# Altium project eco_gyro_analyze.PrjPcb
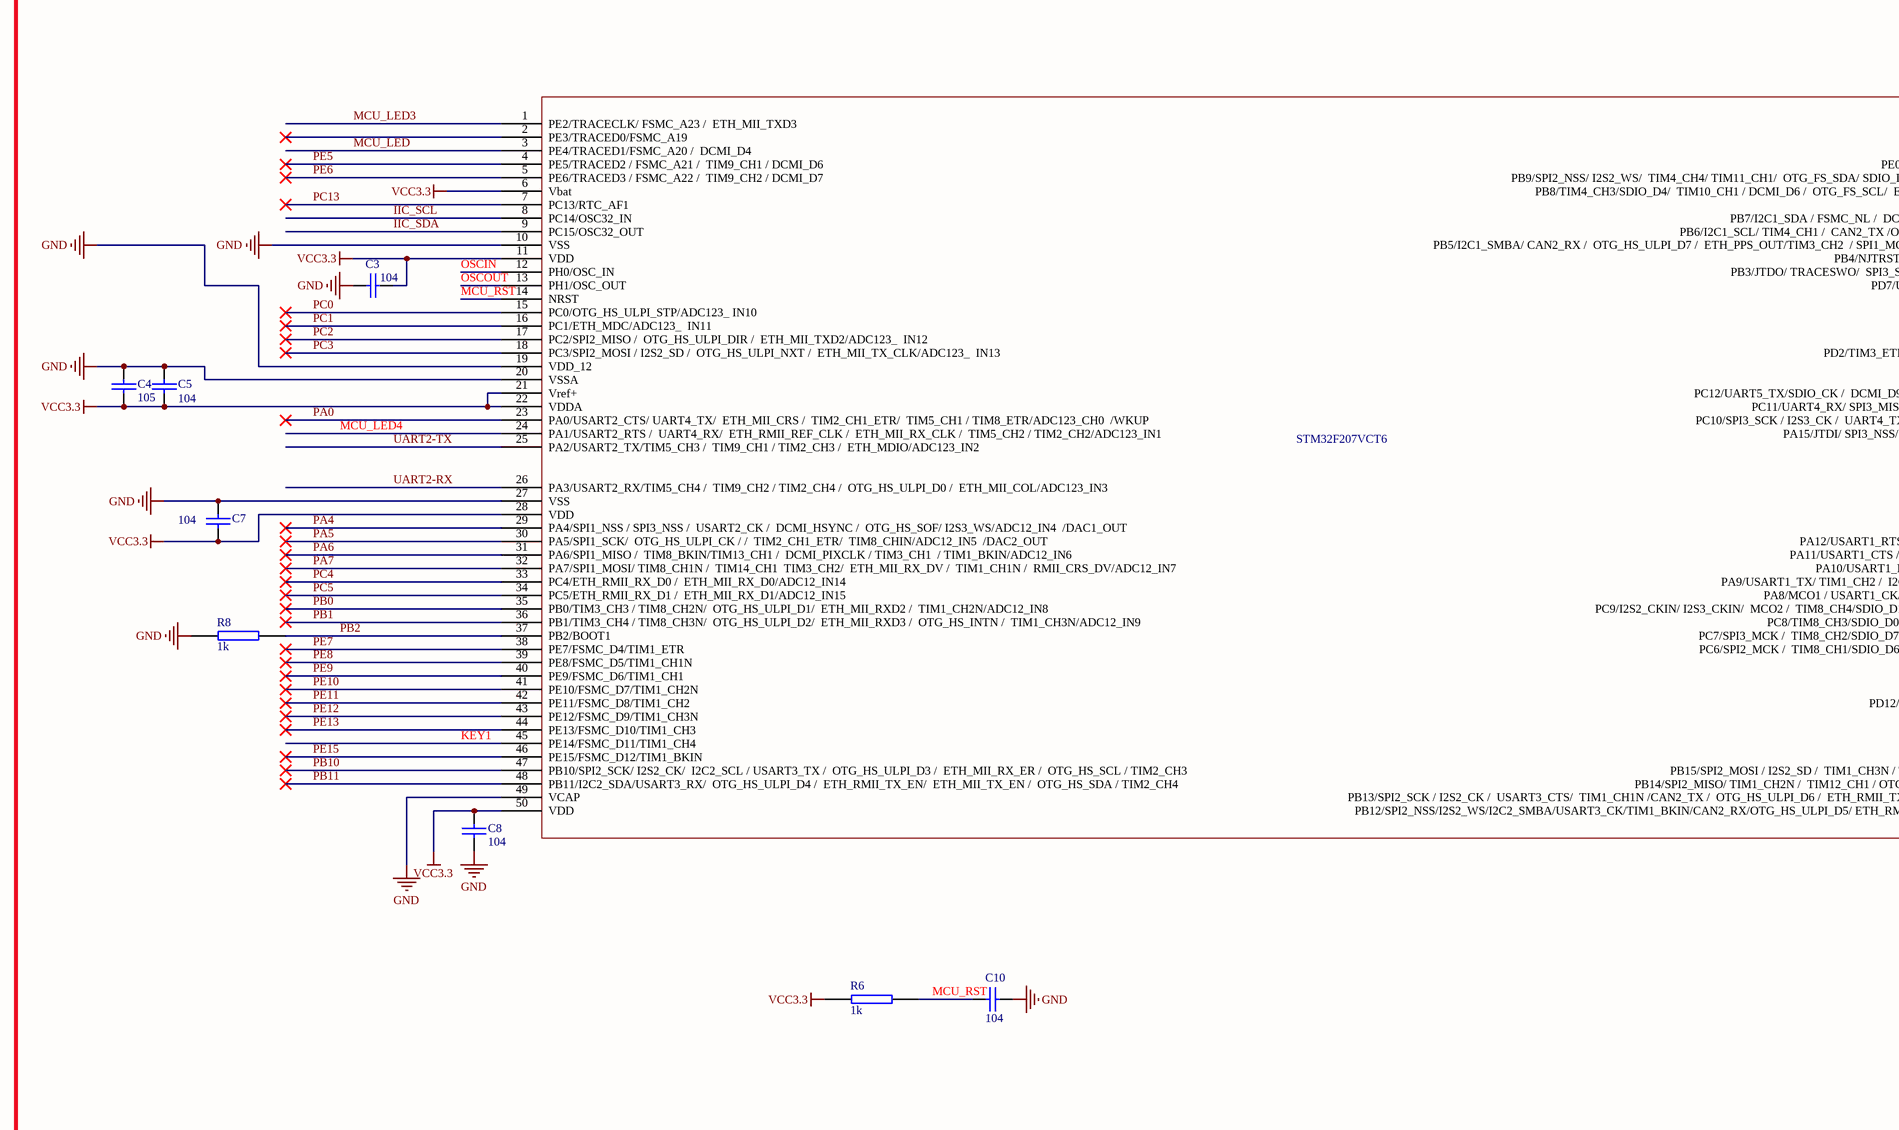
[diagram p0: Sheet1.SchDoc, top left]
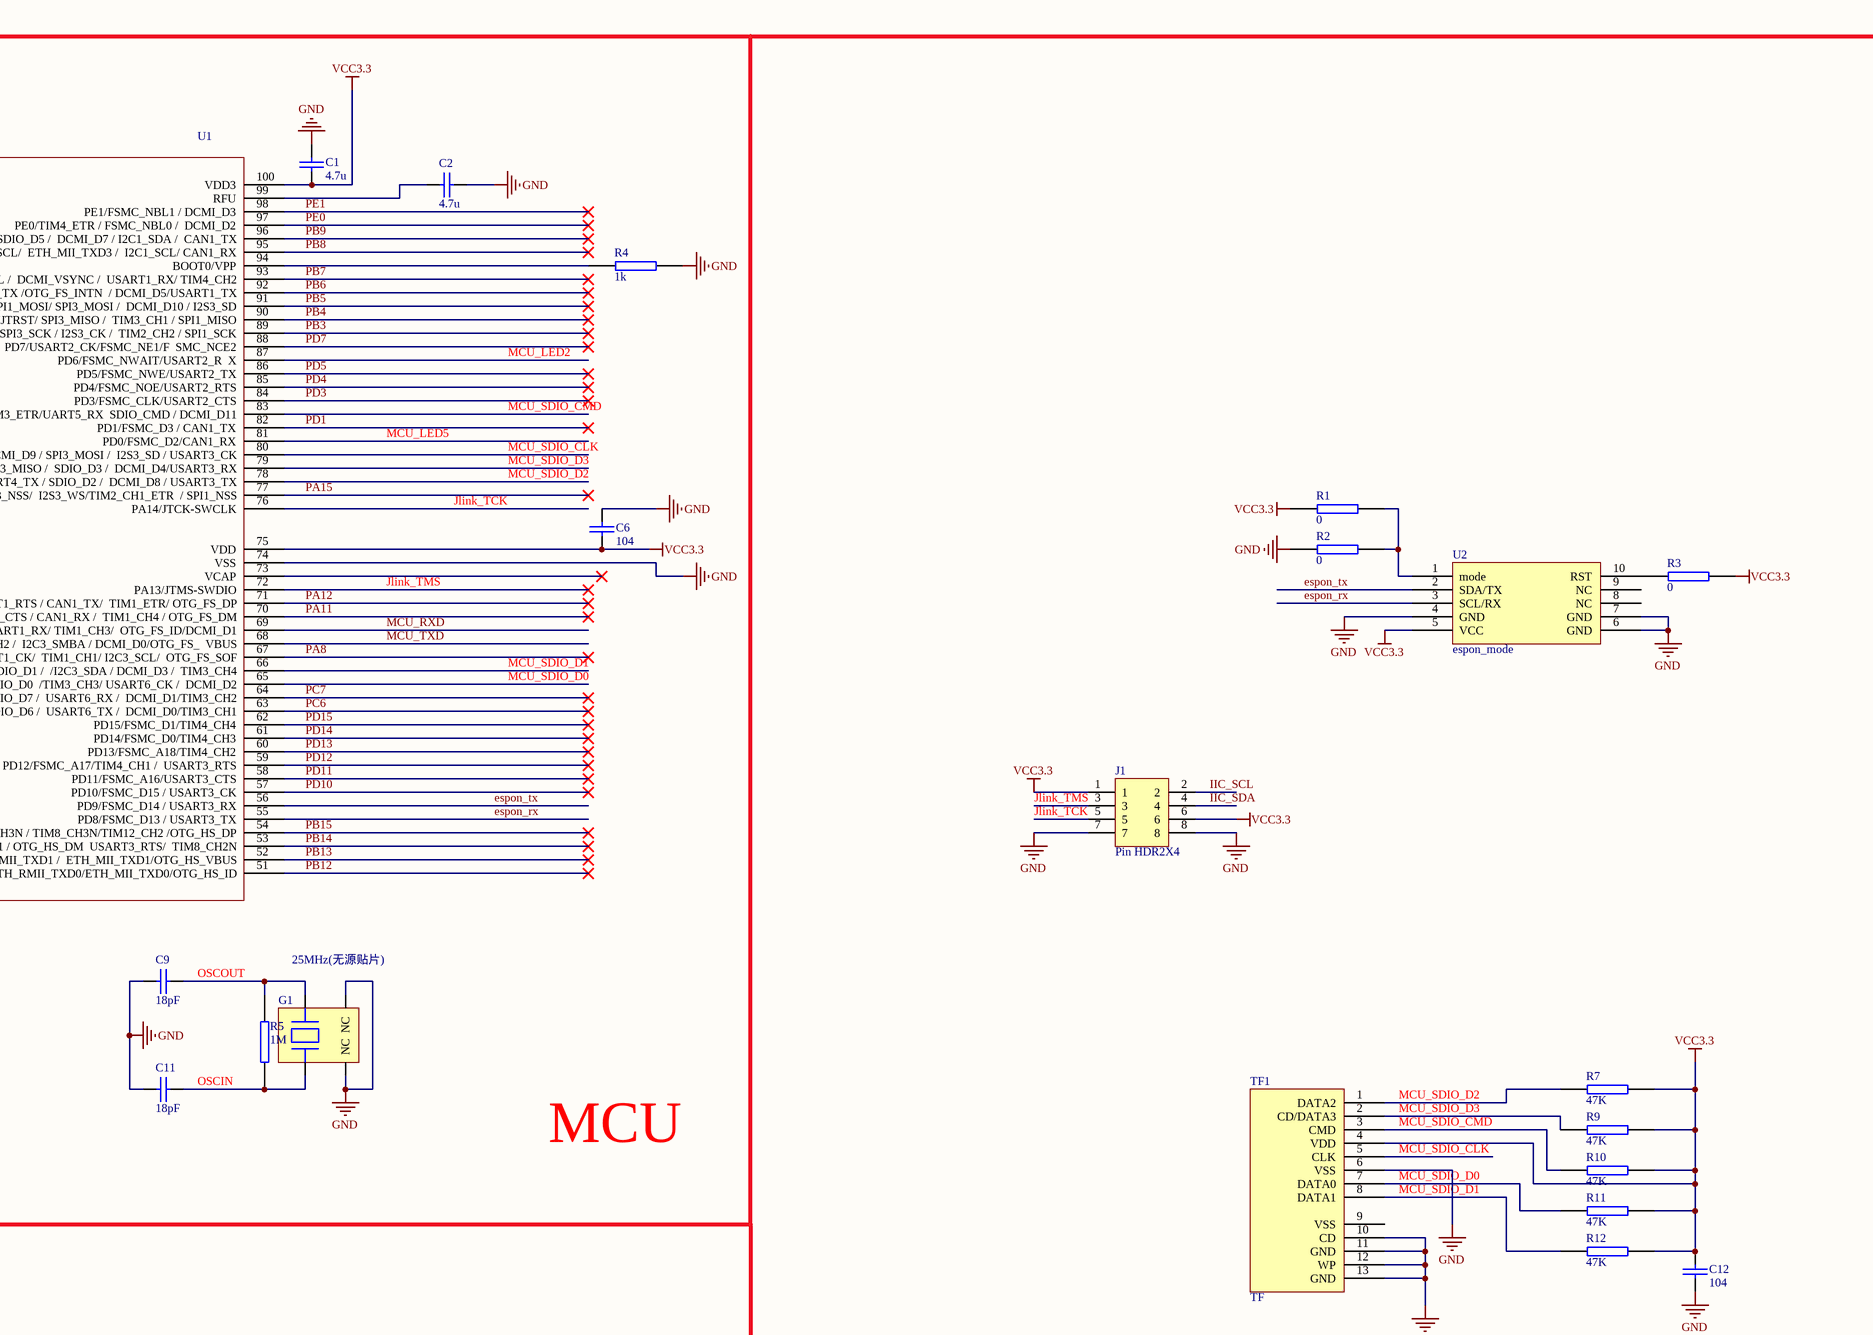
[diagram p1: Sheet1.SchDoc, top middle]
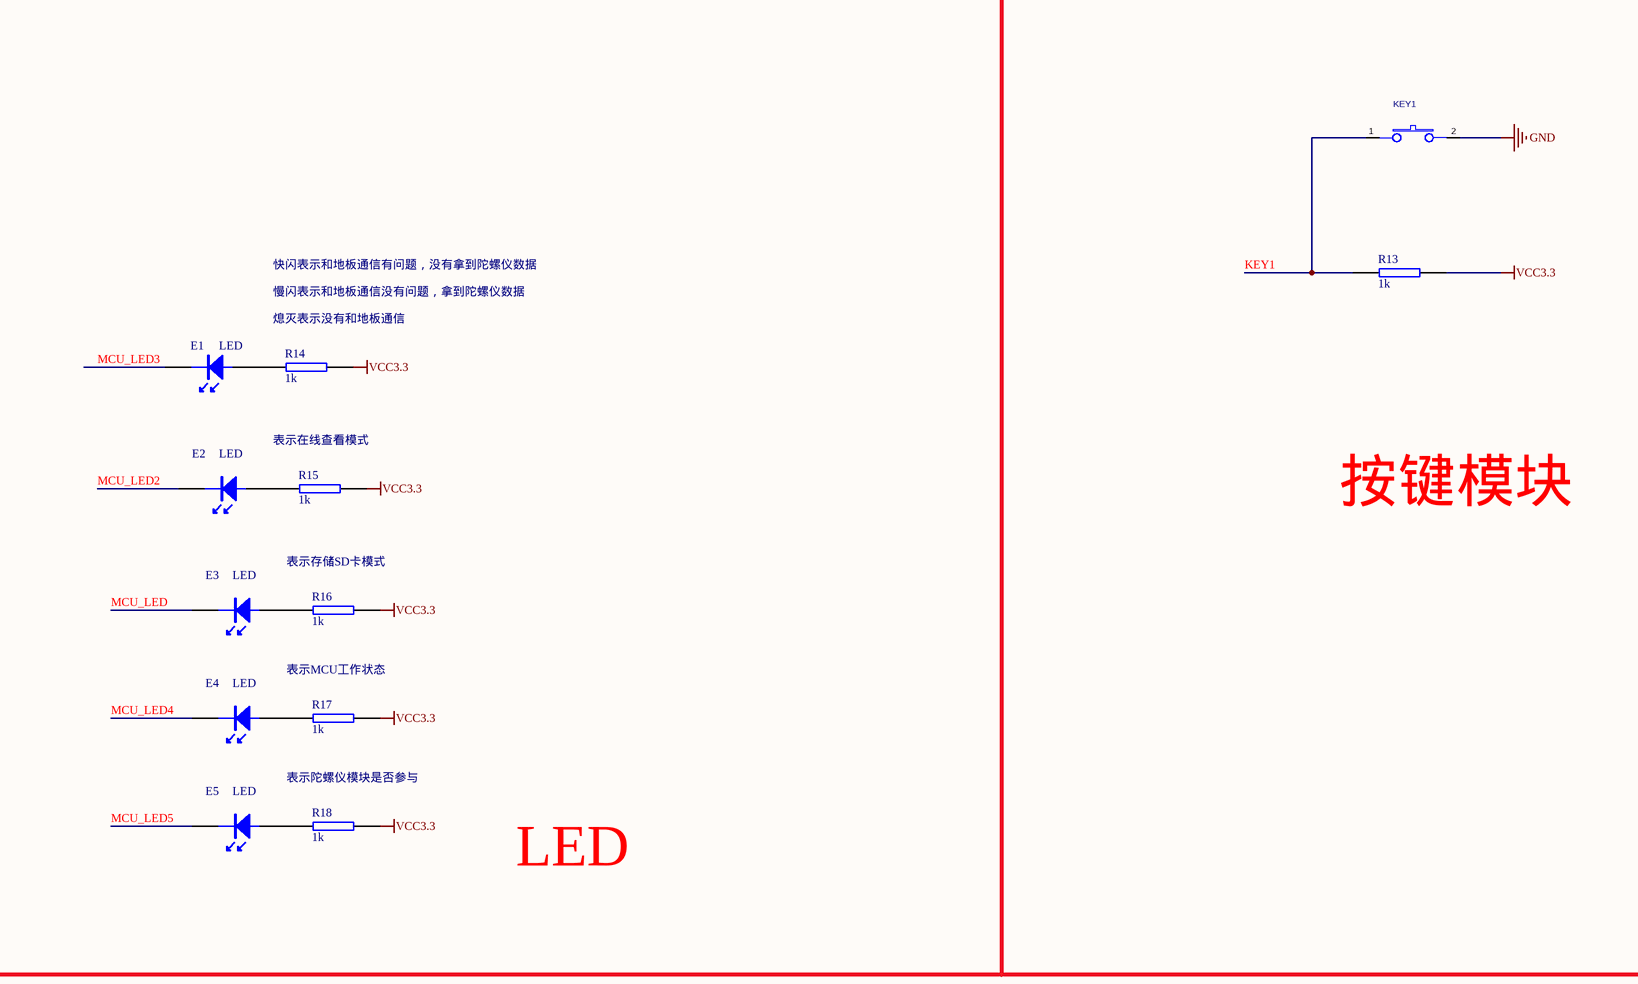
[diagram p2: Sheet1.SchDoc, bottom left]
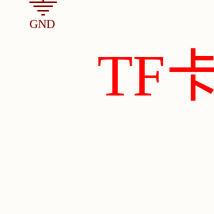
[diagram p3: Sheet1.SchDoc, bottom middle]
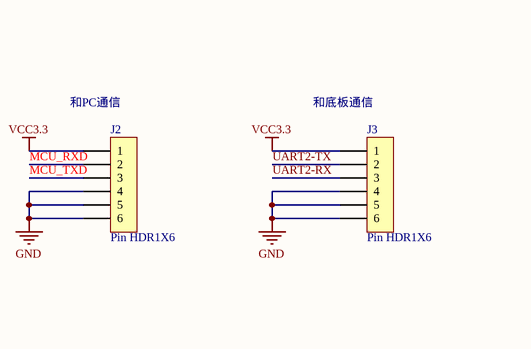
[diagram p4: Sheet1.SchDoc, bottom right]
1 sheet, 43 parts. Net scope: global (net labels, ports and power ports of the same name join across sheets).
Board file: PCB1.PcbDoc

## Sheet Sheet1.SchDoc
size A0

### Parts
C1  4.7u  [0603]
C2  4.7u  [0603]
C3  104  [0603]
C4  105  [0603]
C5  104  [0603]
C6  104  [0603]
C7  104  [0603]
C8  104  [0603]
C9  18pF  [0603]
C10  104  [0603]
C11  18pF  [0603]
C12  104  [0603]
E1  LED  [LED_0603L]
E2  LED  [LED_0603L]
E3  LED  [LED_0603L]
E4  LED  [LED_0603L]
E5  LED  [LED_0603L]
G1  25MHz(无源贴片)  [G3225]
J1  Pin HDR2X4  [PIN HDR2X4/2.54SMD]
J2  Pin HDR1X6  [PIN GH1.25-4ping SMD]
J3  Pin HDR1X6  [PIN GH1.25-4ping SMD]
KEY1  H-3650AADW(NC)  [SW_PB_2P]  (value not drawn)
R1  0  [0603]
R2  0  [0603]
R3  0  [0603]
R4  1k  [0603]
R5  1M  [0603]
R6  1k  [0603]
R7  47K  [0603]
R8  1k  [0603]
R9  47K  [0603]
R10  47K  [0603]
R11  47K  [0603]
R12  47K  [0603]
R13  1k  [0603]
R14  1k  [0603]
R15  1k  [0603]
R16  1k  [0603]
R17  1k  [0603]
R18  1k  [0603]
TF1  TF  [TF]
U1  STM32F207VCT6  [LQFP-100]
U2  espon_mode  [espon_mode]

### Nets
GND: C1.2 C2.1 C3.1 C4.2 C5.2 C6.2 C7.2 C8.2 C9.1 C10.2 C11.1 C12.2 G1.2(NC) G1.4(NC) J1.7 J1.8 J2.4 J2.5 J2.6 J3.4 J3.5 J3.6 KEY1.2 R2.1 R4.1 R8.1 TF1.6(VSS) TF1.10(CD) TF1.11(GND) TF1.12(WP) TF1.13(GND) U1.10(VSS) U1.19(VDD_12) U1.20(VSSA) U1.27(VSS) U1.49(VCAP) U1.74(VSS) U2.4(GND) U2.6(GND) U2.7(GND)
VCC3.3: C1.1 C3.2 C4.1 C5.1 C6.1 C7.1 C8.1 C12.1 J1.1 J1.6 J2.1 J3.1 R1.1 R3.2 R6.2 R7.2 R9.2 R10.2 R11.2 R12.2 R13.2 R14.2 R15.2 R16.2 R17.2 R18.2 TF1.4(VDD) U1.6(Vbat) U1.11(VDD) U1.21(Vref+) U1.22(VDDA) U1.28(VDD) U1.50(VDD) U1.75(VDD) U1.100(VDD3) U2.5(VCC)
espon_rx: U1.55(PD8/FSMC_D13_/_USART3_TX) U2.3(SCL/RX)
espon_tx: U1.56(PD9/FSMC_D14_/_USART3_RX) U2.2(SDA/TX)
IIC_SCL: J1.2 U1.8(PC14/OSC32_IN)
IIC_SDA: J1.4 U1.9(PC15/OSC32_OUT)
Jlink_TCK: J1.5 U1.76(PA14/JTCK-SWCLK)
Jlink_TMS: J1.3 U1.72(PA13/JTMS-SWDIO)
KEY1: KEY1.1 R13.1 U1.45(PE14/FSMC_D11/TIM1_CH4)
MCU_LED: E3.2 U1.3(PE4/TRACED1/FSMC_A20_/__DCMI_D4)
MCU_LED2: E2.2 U1.87(PD6/FSMC_NWAIT/USART2_R__X)
MCU_LED3: E1.2 U1.1(PE2/TRACECLK/_FSMC_A23_/__ETH_MII_TXD3)
MCU_LED4: E4.2 U1.24(PA1/USART2_RTS_/__UART4_RX/__ETH_RMII_REF_CLK_/__ETH_MII_RX_CLK_/__TIM5_CH2_/_TIM2_CH2/ADC123_IN1)
MCU_LED5: E5.2 U1.81(PD0/FSMC_D2/CAN1_RX)
MCU_RST: C10.1 R6.1 U1.14(NRST)
MCU_RXD: J2.2 U1.69(PA10/USART1_RX/_TIM1_CH3/__OTG_FS_ID/DCMI_D1)
MCU_SDIO_CLK: TF1.5(CLK) U1.80(PC12/UART5_TX/SDIO_CK_/__DCMI_D9_/_SPI3_MOSI_/__I2S3_SD_/_USART3_CK)
MCU_SDIO_CMD: R10.1 TF1.3(CMD) U1.83(PD2/TIM3_ETR/UART5_RX__SDIO_CMD_/_DCMI_D11)
MCU_SDIO_D0: R11.1 TF1.7(DATA0) U1.65(PC8/TIM8_CH3/SDIO_D0__/TIM3_CH3/_USART6_CK_/__DCMI_D2)
MCU_SDIO_D1: R12.1 TF1.8(DATA1) U1.66(PC9/I2S2_CKIN/_I2S3_CKIN/__MCO2_/__TIM8_CH4/SDIO_D1_/__/I2C3_SDA_/_DCMI_D3_/__TIM3_CH4)
MCU_SDIO_D2: R7.1 TF1.1(DATA2) U1.78(PC10/SPI3_SCK_/_I2S3_CK_/__UART4_TX_/_SDIO_D2_/__DCMI_D8_/_USART3_TX)
MCU_SDIO_D3: R9.1 TF1.2(CD/DATA3) U1.79(PC11/UART4_RX/_SPI3_MISO_/__SDIO_D3_/__DCMI_D4/USART3_RX)
MCU_TXD: J2.3 U1.68(PA9/USART1_TX/_TIM1_CH2_/__I2C3_SMBA_/_DCMI_D0/OTG_FS___VBUS)
OSCIN: C11.2 G1.1 R5.2 U1.12(PH0/OSC_IN)
OSCOUT: C9.2 G1.3 R5.1 U1.13(PH1/OSC_OUT)
PA0: U1.23(PA0/USART2_CTS/_UART4_TX/__ETH_MII_CRS_/__TIM2_CH1_ETR/__TIM5_CH1_/_TIM8_ETR/ADC123_CH0__/WKUP)
PA4: U1.29(PA4/SPI1_NSS_/_SPI3_NSS_/__USART2_CK_/__DCMI_HSYNC_/__OTG_HS_SOF/_I2S3_WS/ADC12_IN4__/DAC1_OUT)
PA5: U1.30(PA5/SPI1_SCK/__OTG_HS_ULPI_CK_/_/__TIM2_CH1_ETR/__TIM8_CHIN/ADC12_IN5__/DAC2_OUT)
PA6: U1.31(PA6/SPI1_MISO_/__TIM8_BKIN/TIM13_CH1_/__DCMI_PIXCLK_/_TIM3_CH1__/_TIM1_BKIN/ADC12_IN6)
PA7: U1.32(PA7/SPI1_MOSI/_TIM8_CH1N_/__TIM14_CH1__TIM3_CH2/__ETH_MII_RX_DV_/__TIM1_CH1N_/__RMII_CRS_DV/ADC12_IN7)
PA8: U1.67(PA8/MCO1_/_USART1_CK/__TIM1_CH1/_I2C3_SCL/__OTG_FS_SOF)
PA11: U1.70(PA11/USART1_CTS_/_CAN1_RX_/__TIM1_CH4_/_OTG_FS_DM)
PA12: U1.71(PA12/USART1_RTS_/_CAN1_TX/__TIM1_ETR/_OTG_FS_DP)
PA15: U1.77(PA15/JTDI/_SPI3_NSS/__I2S3_WS/TIM2_CH1_ETR__/_SPI1_NSS)
PB0: U1.35(PB0/TIM3_CH3_/_TIM8_CH2N/__OTG_HS_ULPI_D1/__ETH_MII_RXD2_/__TIM1_CH2N/ADC12_IN8)
PB1: U1.36(PB1/TIM3_CH4_/_TIM8_CH3N/__OTG_HS_ULPI_D2/__ETH_MII_RXD3_/__OTG_HS_INTN_/__TIM1_CH3N/ADC12_IN9)
PB2: R8.2 U1.37(PB2/BOOT1)
PB3: U1.89(PB3/JTDO/_TRACESWO/__SPI3_SCK_/_I2S3_CK_/__TIM2_CH2_/_SPI1_SCK)
PB4: U1.90(PB4/NJTRST/_SPI3_MISO_/__TIM3_CH1_/_SPI1_MISO)
PB5: U1.91(PB5/I2C1_SMBA/_CAN2_RX_/__OTG_HS_ULPI_D7_/__ETH_PPS_OUT/TIM3_CH2__/_SPI1_MOSI/_SPI3_MOSI_/__DCMI_D10_/_I2S3_SD)
PB6: U1.92(PB6/I2C1_SCL/_TIM4_CH1_/__CAN2_TX_/OTG_FS_INTN__/_DCMI_D5/USART1_TX)
PB7: U1.93(PB7/I2C1_SDA_/_FSMC_NL_/__DCMI_VSYNC_/__USART1_RX/_TIM4_CH2)
PB8: U1.95(PB8/TIM4_CH3/SDIO_D4/__TIM10_CH1_/_DCMI_D6_/__OTG_FS_SCL/__ETH_MII_TXD3_/__I2C1_SCL/_CAN1_RX)
PB9: U1.96(PB9/SPI2_NSS/_I2S2_WS/__TIM4_CH4/_TIM11_CH1/__OTG_FS_SDA/_SDIO_D5_/__DCMI_D7_/_I2C1_SDA_/__CAN1_TX)
PB10: U1.47(PB10/SPI2_SCK/_I2S2_CK/__I2C2_SCL_/_USART3_TX_/__OTG_HS_ULPI_D3_/__ETH_MII_RX_ER_/__OTG_HS_SCL_/_TIM2_CH3)
PB11: U1.48(PB11/I2C2_SDA/USART3_RX/__OTG_HS_ULPI_D4_/__ETH_RMII_TX_EN/__ETH_MII_TX_EN_/__OTG_HS_SDA_/_TIM2_CH4)
PB12: U1.51(PB12/SPI2_NSS/I2S2_WS/I2C2_SMBA/USART3_CK/TIM1_BKIN/CAN2_RX/OTG_HS_ULPI_D5/_ETH_RMII_TXD0/ETH_MII_TXD0/OTG_HS_ID)
PB13: U1.52(PB13/SPI2_SCK_/_I2S2_CK_/__USART3_CTS/__TIM1_CH1N_/CAN2_TX_/__OTG_HS_ULPI_D6_/__ETH_RMII_TXD1_/__ETH_MII_TXD1/OTG_HS_VBUS)
PB14: U1.53(PB14/SPI2_MISO/_TIM1_CH2N_/__TIM12_CH1_/_OTG_HS_DM__USART3_RTS/__TIM8_CH2N)
PB15: U1.54(PB15/SPI2_MOSI_/_I2S2_SD_/__TIM1_CH3N_/_TIM8_CH3N/TIM12_CH2_/OTG_HS_DP)
PC0: U1.15(PC0/OTG_HS_ULPI_STP/ADC123__IN10)
PC1: U1.16(PC1/ETH_MDC/ADC123___IN11)
PC2: U1.17(PC2/SPI2_MISO_/__OTG_HS_ULPI_DIR_/__ETH_MII_TXD2/ADC123___IN12)
PC3: U1.18(PC3/SPI2_MOSI_/_I2S2_SD_/__OTG_HS_ULPI_NXT_/__ETH_MII_TX_CLK/ADC123___IN13)
PC4: U1.33(PC4/ETH_RMII_RX_D0_/__ETH_MII_RX_D0/ADC12_IN14)
PC5: U1.34(PC5/ETH_RMII_RX_D1_/__ETH_MII_RX_D1/ADC12_IN15)
PC6: U1.63(PC6/SPI2_MCK_/__TIM8_CH1/SDIO_D6_/__USART6_TX_/__DCMI_D0/TIM3_CH1)
PC7: U1.64(PC7/SPI3_MCK_/__TIM8_CH2/SDIO_D7_/__USART6_RX_/__DCMI_D1/TIM3_CH2)
PC13: U1.7(PC13/RTC_AF1)
PD1: U1.82(PD1/FSMC_D3_/_CAN1_TX)
PD3: U1.84(PD3/FSMC_CLK/USART2_CTS)
PD4: U1.85(PD4/FSMC_NOE/USART2_RTS)
PD5: U1.86(PD5/FSMC_NWE/USART2_TX)
PD7: U1.88(PD7/USART2_CK/FSMC_NE1/F__SMC_NCE2)
PD10: U1.57(PD10/FSMC_D15_/_USART3_CK)
PD11: U1.58(PD11/FSMC_A16/USART3_CTS)
PD12: U1.59(PD12/FSMC_A17/TIM4_CH1_/__USART3_RTS)
PD13: U1.60(PD13/FSMC_A18/TIM4_CH2)
PD14: U1.61(PD14/FSMC_D0/TIM4_CH3)
PD15: U1.62(PD15/FSMC_D1/TIM4_CH4)
PE0: U1.97(PE0/TIM4_ETR_/_FSMC_NBL0_/__DCMI_D2)
PE1: U1.98(PE1/FSMC_NBL1_/_DCMI_D3)
PE5: U1.4(PE5/TRACED2_/_FSMC_A21_/__TIM9_CH1_/_DCMI_D6)
PE6: U1.5(PE6/TRACED3_/_FSMC_A22_/__TIM9_CH2_/_DCMI_D7)
PE7: U1.38(PE7/FSMC_D4/TIM1_ETR)
PE8: U1.39(PE8/FSMC_D5/TIM1_CH1N)
PE9: U1.40(PE9/FSMC_D6/TIM1_CH1)
PE10: U1.41(PE10/FSMC_D7/TIM1_CH2N)
PE11: U1.42(PE11/FSMC_D8/TIM1_CH2)
PE12: U1.43(PE12/FSMC_D9/TIM1_CH3N)
PE13: U1.44(PE13/FSMC_D10/TIM1_CH3)
PE15: U1.46(PE15/FSMC_D12/TIM1_BKIN)
UART2-RX: J3.3 U1.26(PA3/USART2_RX/TIM5_CH4_/__TIM9_CH2_/_TIM2_CH4_/__OTG_HS_ULPI_D0_/__ETH_MII_COL/ADC123_IN3)
UART2-TX: J3.2 U1.25(PA2/USART2_TX/TIM5_CH3_/__TIM9_CH1_/_TIM2_CH3_/__ETH_MDIO/ADC123_IN2)
NetC2_2: C2.2 U1.99(RFU)
NetE1_1: E1.1 R14.1
NetE2_1: E2.1 R15.1
NetE3_1: E3.1 R16.1
NetE4_1: E4.1 R17.1
NetE5_1: E5.1 R18.1
NetR1_2: R1.2 R2.2 U2.1(mode)
NetR3_1: R3.1 U2.10(RST)
NetR4_2: R4.2 U1.94(BOOT0/VPP)

Not connected (* = marked no-connect by the designer): TF1 9(VSS); U1 2(PE3/TRACED0/FSMC_A19)* 73(VCAP)*; U2 8(NC) 9(NC)

### Notes on the sheet
- MCU
- TF卡
- (near J2) 和PC通信
- (near J3) 和底板通信
- 快闪表示和地板通信有问题，没有拿到陀螺仪数据
- 熄灭表示没有和地板通信
- 慢闪表示和地板通信没有问题，拿到陀螺仪数据
- 表示在线查看模式
- 按键模块
- 表示存储SD卡模式
- 表示MCU工作状态
- 表示陀螺仪模块是否参与
- LED

### Library data of the parts
C1-C8 C10 = CAP: 贴片电容
C9 C11 = CAP: 无极电容
C12 = CAP Nonpolarity: 无极电容
E1-E5 = LED: LED灯
G1 = MM-11B: 无源晶振MCU使用
KEY1 = SW_PB_2P: 贴片按钮-2PIN(NC); CLASS: IO; PCB DECAL: SWEVQPA; Source_Path: E:\PROJECT\FREESCALE\IMX6\SCH\IMX_LIBRARY.OLB; Manufacturer: ?; MFG_NAME01: ?; Manufacturer_Part_Number: ?; MFG_PN01: ?; Value: SW_PB_2P
R1-R18 = R: 电阻
TF1 = TF: TF卡
U1 = STM32F207-1